# EAGLE design Cargador_Baterias (EAGLE 9.6.2)
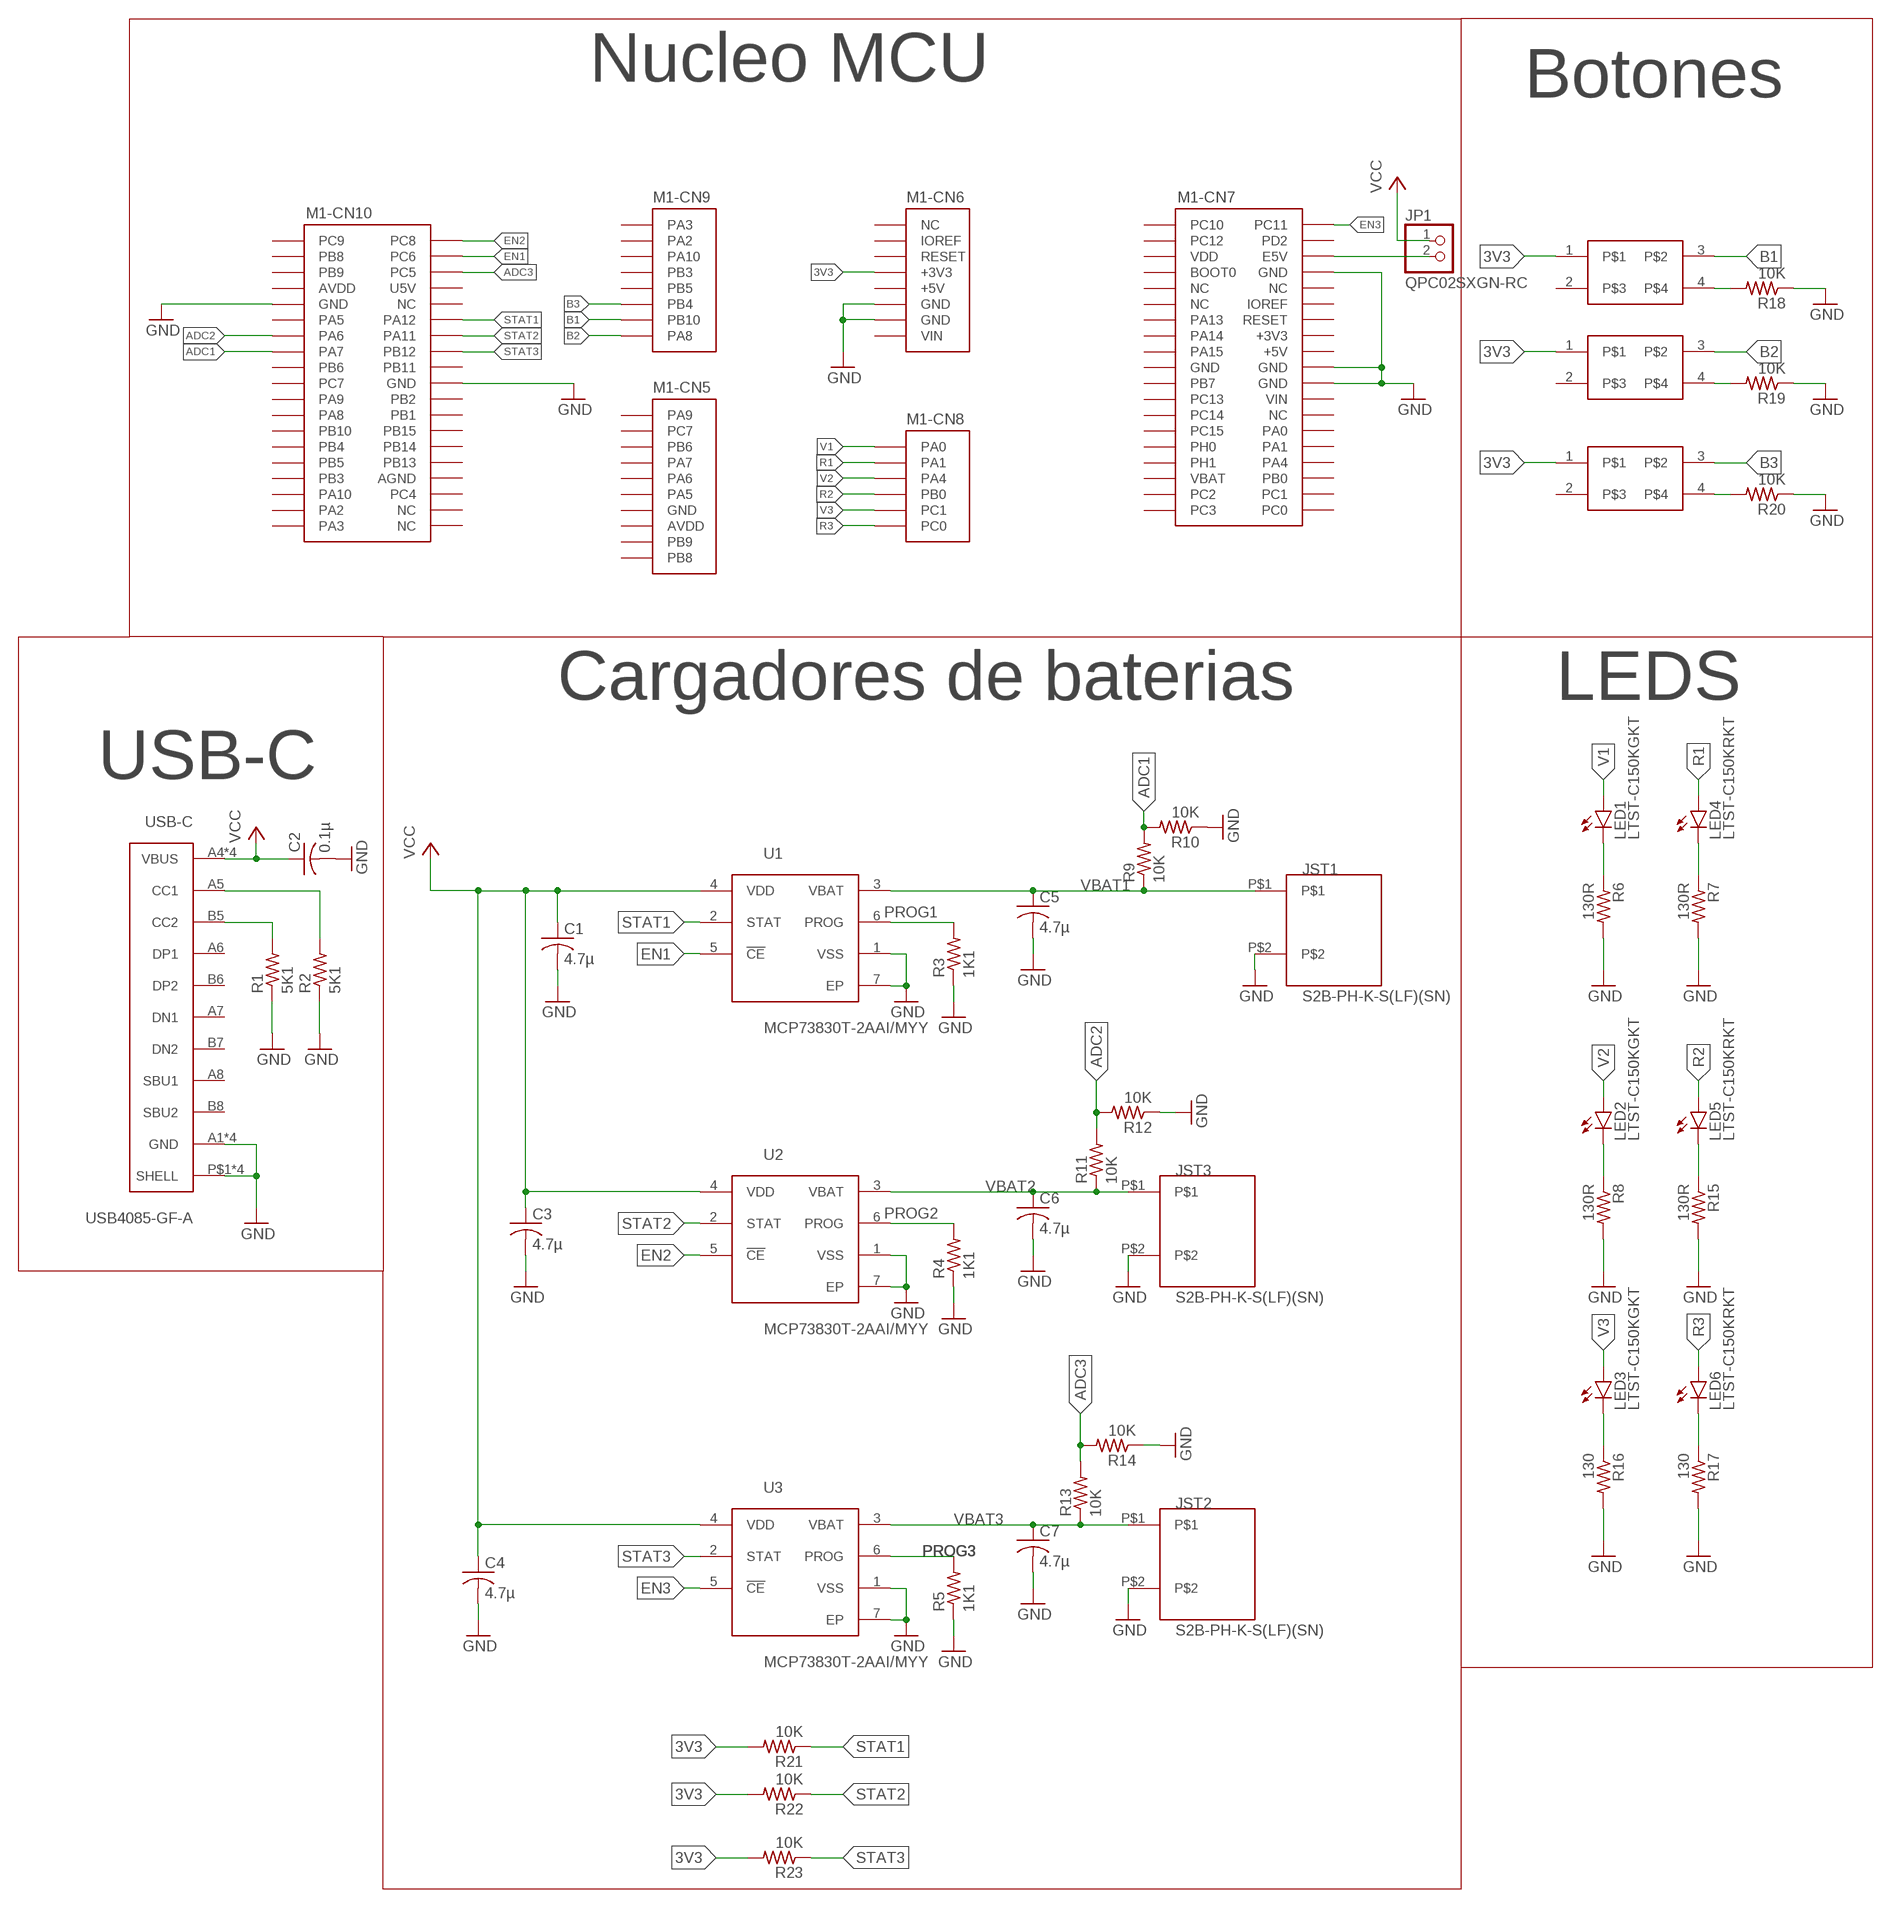
[diagram p0: schematic, sheet 1]

## Parts
BOTON1  PTS645SM43SMTR92 LFS  PTS645SM43SMTR92LFS  [PTS645SM43SMTR92LFS]
BOTON2  PTS645SM43SMTR92 LFS  PTS645SM43SMTR92LFS  [PTS645SM43SMTR92LFS]
BOTON3  PTS645SM43SMTR92 LFS  PTS645SM43SMTR92LFS  [PTS645SM43SMTR92LFS]
C1  4.7µ  C-USC0805  [C0805]
C2  0.1µ  C-USC0805  [C0805]
C3  4.7µ  C-USC0805  [C0805]
C4  4.7µ  C-USC0805  [C0805]
C5  4.7µ  C-USC0805  [C0805]
C6  4.7µ  C-USC0805  [C0805]
C7  4.7µ  C-USC0805  [C0805]
JP1  QPC02SXGN-RC  PINHD-1X2  [1X02]
JST1  S2B-PH-K-S(LF)(SN)  [BULK]
JST2  S2B-PH-K-S(LF)(SN)  [BULK]
JST3  S2B-PH-K-S(LF)(SN)  [BULK]
LED1  LTST-C150KGKT  LTST-C150KGKTSMT1206  [1206]
LED2  LTST-C150KGKT  LTST-C150KGKTSMT1206  [1206]
LED3  LTST-C150KGKT  LTST-C150KGKTSMT1206  [1206]
LED4  LTST-C150KRKT  LTST-C150KRKTSMT1206  [1206]
LED5  LTST-C150KRKT  LTST-C150KRKTSMT1206  [1206]
LED6  LTST-C150KRKT  LTST-C150KRKTSMT1206  [1206]
M1  NUCLEO-L452RE  [NUCLEO-64]
R1  5K1  R-US_R0805  [R0805]
R2  5K1  R-US_R0805  [R0805]
R3  1K1  R-US_R0805  [R0805]
R4  1K1  R-US_R0805  [R0805]
R5  1K1  R-US_R0805  [R0805]
R6  130R  R-US_R0805  [R0805]
R7  130R  R-US_R0805  [R0805]
R8  130R  R-US_R0805  [R0805]
R9  10K  R-US_R0805  [R0805]
R10  10K  R-US_R0805  [R0805]
R11  10K  R-US_R0805  [R0805]
R12  10K  R-US_R0805  [R0805]
R13  10K  R-US_R0805  [R0805]
R14  10K  R-US_R0805  [R0805]
R15  130R  R-US_R0805  [R0805]
R16  130  R-US_R0805  [R0805]
R17  130  R-US_R0805  [R0805]
R18  10K  R-US_R0805  [R0805]
R19  10K  R-US_R0805  [R0805]
R20  10K  R-US_R0805  [R0805]
R21  10K  R-US_R0805  [R0805]
R22  10K  R-US_R0805  [R0805]
R23  10K  R-US_R0805  [R0805]
U1  MCP73830T-2AAI/MYY  [6-TDFN(2X2)]
U2  MCP73830T-2AAI/MYY  [6-TDFN(2X2)]
U3  MCP73830T-2AAI/MYY  [6-TDFN(2X2)]
USB-C  USB4085-GF-A  [USB4085-GF-A]

## Nets
3V3: BOTON1.1 BOTON2.1 BOTON3.1 M1.CN6-4(-CN6:+3V3) R21.2 R22.2 R23.2
ADC1: M1.CN10-15(-CN10:PA7) R9.2 R10.2
ADC2: M1.CN10-13(-CN10:PA6) R11.2 R12.2
ADC3: M1.CN10-6(-CN10:PC5) R13.2 R14.2
B1: BOTON1.3 M1.CN9-7(-CN9:PB10)
B2: BOTON2.3 M1.CN9-8(-CN9:PA8)
B3: BOTON3.3 M1.CN9-6(-CN9:PB4)
EN1: M1.CN10-4(-CN10:PC6) U1.5(!CE)
EN2: M1.CN10-2(-CN10:PC8) U2.5(!CE)
EN3: M1.CN7-2(-CN7:PC11) U3.5(!CE)
GND: C1.2 C2.2 C3.2 C4.2 C5.2 C6.2 C7.2 JST1.P$2 JST2.P$2 JST3.P$2 M1.CN6-6(-CN6:GND) M1.CN6-7(-CN6:GND) M1.CN7-19(-CN7:GND) M1.CN7-20(-CN7:GND) M1.CN7-22(-CN7:GND) M1.CN10-9(-CN10:GND) M1.CN10-20(-CN10:GND) R1.1 R2.1 R3.1 R4.1 R5.1 R6.2 R7.2 R8.2 R10.1 R12.1 R14.1 R15.2 R16.2 R17.2 R18.1 R19.1 R20.1 U1.1(VSS) U1.7(EP) U2.1(VSS) U2.7(EP) U3.1(VSS) U3.7(EP) USB-C.A1(GND) USB-C.A12(GND) USB-C.B1(GND) USB-C.B12(GND) USB-C.P$1(SHELL) USB-C.P$2(SHELL) USB-C.P$3(SHELL) USB-C.P$4(SHELL)
N$1: R1.2 USB-C.B5(CC2)
N$2: R2.2 USB-C.A5(CC1)
N$3: LED1.C R6.1
N$4: LED4.C R7.1
N$5: LED2.C R8.1
N$6: LED5.C R15.1
N$8: JP1.2 M1.CN7-6(-CN7:E5V)
N$10: LED3.C R16.1
N$11: LED6.C R17.1
N$12: BOTON1.4 R18.2
N$13: BOTON2.4 R19.2
N$14: BOTON3.4 R20.2
PROG1: R3.2 U1.6(PROG)
PROG2: R4.2 U2.6(PROG)
PROG3: R5.2 U3.6(PROG)
R1: LED4.A M1.CN8-2(-CN8:PA1)
R2: LED5.A M1.CN8-4(-CN8:PB0)
R3: LED6.A M1.CN8-6(-CN8:PC0)
STAT1: M1.CN10-12(-CN10:PA12) R21.1 U1.2(STAT)
STAT2: M1.CN10-14(-CN10:PA11) R22.1 U2.2(STAT)
STAT3: M1.CN10-16(-CN10:PB12) R23.1 U3.2(STAT)
V1: LED1.A M1.CN8-1(-CN8:PA0)
V2: LED2.A M1.CN8-3(-CN8:PA4)
V3: LED3.A M1.CN8-5(-CN8:PC1)
VBAT1: C5.1 JST1.P$1 R9.1 U1.3(VBAT)
VBAT2: C6.1 JST3.P$1 R11.1 U2.3(VBAT)
VBAT3: C7.1 JST2.P$1 R13.1 U3.3(VBAT)
VCC: C1.1 C2.1 C3.1 C4.1 JP1.1 U1.4(VDD) U2.4(VDD) U3.4(VDD) USB-C.A4(VBUS) USB-C.A9(VBUS) USB-C.B4(VBUS) USB-C.B9(VBUS)
Unconnected: BOTON1.2 BOTON2.2 BOTON3.2 M1.CN5-1(-CN5:PA9) M1.CN5-2(-CN5:PC7) M1.CN5-3(-CN5:PB6) M1.CN5-4(-CN5:PA7) M1.CN5-5(-CN5:PA6) M1.CN5-6(-CN5:PA5) M1.CN5-9(-CN5:PB9) M1.CN5-10(-CN5:PB8) M1.CN6-1(-CN6:NC) M1.CN6-3(-CN6:RESET) M1.CN7-1(-CN7:PC10) M1.CN7-3(-CN7:PC12) M1.CN7-4(-CN7:PD2) M1.CN7-7(-CN7:BOOT0) M1.CN7-9(-CN7:NC) M1.CN7-10(-CN7:NC) M1.CN7-11(-CN7:NC) M1.CN7-12(-CN7:IOREF) M1.CN7-13(-CN7:PA13) M1.CN7-14(-CN7:RESET) M1.CN7-15(-CN7:PA14) M1.CN7-17(-CN7:PA15) M1.CN7-21(-CN7:PB7) M1.CN7-23(-CN7:PC13) M1.CN7-25(-CN7:PC14) M1.CN7-26(-CN7:NC) M1.CN7-27(-CN7:PC15) M1.CN7-28(-CN7:PA0) M1.CN7-29(-CN7:PH0) M1.CN7-30(-CN7:PA1) M1.CN7-31(-CN7:PH1) M1.CN7-32(-CN7:PA4) M1.CN7-34(-CN7:PB0) M1.CN7-35(-CN7:PC2) M1.CN7-36(-CN7:PC1) M1.CN7-37(-CN7:PC3) M1.CN7-38(-CN7:PC0) M1.CN9-1(-CN9:PA3) M1.CN9-2(-CN9:PA2) M1.CN9-3(-CN9:PA10) M1.CN9-4(-CN9:PB3) M1.CN9-5(-CN9:PB5) M1.CN10-1(-CN10:PC9) M1.CN10-3(-CN10:PB8) M1.CN10-5(-CN10:PB9) M1.CN10-10(-CN10:NC) M1.CN10-11(-CN10:PA5) M1.CN10-17(-CN10:PB6) M1.CN10-18(-CN10:PB11) M1.CN10-19(-CN10:PC7) M1.CN10-21(-CN10:PA9) M1.CN10-22(-CN10:PB2) M1.CN10-23(-CN10:PA8) M1.CN10-24(-CN10:PB1) M1.CN10-25(-CN10:PB10) M1.CN10-26(-CN10:PB15) M1.CN10-27(-CN10:PB4) M1.CN10-28(-CN10:PB14) M1.CN10-29(-CN10:PB5) M1.CN10-30(-CN10:PB13) M1.CN10-31(-CN10:PB3) M1.CN10-33(-CN10:PA10) M1.CN10-34(-CN10:PC4) M1.CN10-35(-CN10:PA2) M1.CN10-36(-CN10:NC) M1.CN10-37(-CN10:PA3) M1.CN10-38(-CN10:NC) USB-C.A6(DP1) USB-C.A7(DN1) USB-C.A8(SBU1) USB-C.B6(DP2) USB-C.B7(DN2) USB-C.B8(SBU2)

## Notes on the sheet
- Nucleo MCU | Botones
- Cargadores de baterias | LEDS
- USB-C

## Power pins joined to a net without a drawn wire
+3V3: M1.CN7-16(-CN7:+3V3)
+5V: M1.CN6-5(-CN6:+5V) M1.CN7-18(-CN7:+5V)
AGND: M1.CN10-32(-CN10:AGND)
AVDD: M1.CN5-8(-CN5:AVDD) M1.CN10-7(-CN10:AVDD)
GND: M1.CN5-7(-CN5:GND) M1.CN7-8(-CN7:GND)
IOREF: M1.CN6-2(-CN6:IOREF)
U5V: M1.CN10-8(-CN10:U5V)
VBAT: M1.CN7-33(-CN7:VBAT)
VDD: M1.CN7-5(-CN7:VDD)
VIN: M1.CN6-8(-CN6:VIN) M1.CN7-24(-CN7:VIN)

## Library data of the parts
BOTON1-BOTON3 = PTS645SM43SMTR92 LFS:PTS645SM43SMTR92LFS; PARTNO: PTS645SM43SMTR92 LFS
C1 C3-C7 = rcl:C-US: CAPACITOR, American symbol; PARTNO: GRM21BR71C475KE51L; SPICEPREFIX: C
C2 = rcl:C-US: CAPACITOR, American symbol; PARTNO: GCJ21BL81H104KA01L; SPICEPREFIX: C
JP1 = pinhead:PINHD-1X2: PIN HEADER; PARTNO: QPC02SXGN-RC
JST1-JST3 = S2B-PH-K-SLFSN:S2B-PH-K-S(LF)(SN); PARTNO: S2B-PH-K-S(LF)(SN)
LED1-LED3 = LTST-C150KGKT:LTST-C150KGKT: LED OSRAM: - CHIPLED LG R971, LG N971, LY N971, LG Q971, LY Q971, LO R971, LY R971 LH N974, LH R974 LS Q976, LO Q976, LY Q976 LO Q996 - Hyper CHIPLED LW Q18S LB Q993, LB Q99A, LB R99A - SideLED LS A670, LO A670, LY A670, LG A670, LP A670 LB A673, LV A673, LT A673, LW A673 LH A674 LY A675 LS A676, LA A676, LO A676, LY A676, LW A676 LS A679, LY A679, LG A679 - Hyper Micro SIDELED® LS Y876, LA Y876, LO Y876, LY Y876 LT Y87S - SmartLED LW L88C, LW L88S LB L89C, LB L89S, LG L890 LS L89K, LO L89K, LY L89K LS L896, LA L896, LO L896, LY L896 - TOPLED LS T670, LO T670, LY T670, LG T670, LP T670 LSG T670, LSP T670, LSY T670, LOP T670, LYG T670 LG T671, LOG T671, LSG T671 LB T673, LV T673, LT T673, LW T673 LH T674 LS T676, LA T676, LO T676, LY T676, LB T676, LH T676, LSB T676, LW T676 LB T67C, LV T67C, LT T67C, LS T67K, LO T67K, LY T67K, LW E67C LS E67B, LA E67B, LO E67B, LY E67B, LB E67C, LV E67C, LT E67C LW T67C LS T679, LY T679, LG T679 LS T770, LO T770, LY T770, LG T770, LP T770 LB T773, LV T773, LT T773, LW T773 LH T774 LS E675, LA E675, LY E675, LS T675 LS T776, LA T776, LO T776, LY T776, LB T776 LHGB T686 LT T68C, LB T68C - Hyper Mini TOPLED® LB M676 - Mini TOPLED Santana® LG M470 LS M47K, LO M47K, LY M47K Source: http://www.osram.convergy.de LUXEON: - LUMILED® LXK2-PW12-R00, LXK2-PW12-S00, LXK2-PW14-U00, LXK2-PW14-V00 LXK2-PM12-R00, LXK2-PM12-S00, LXK2-PM14-U00 LXK2-PE12-Q00, LXK2-PE12-R00, LXK2-PE12-S00, LXK2-PE14-T00, LXK2-PE14-U00 LXK2-PB12-K00, LXK2-PB12-L00, LXK2-PB12-M00, LXK2-PB14-N00, LXK2-PB14-P00, LXK2-PB14-Q00 LXK2-PR12-L00, LXK2-PR12-M00, LXK2-PR14-Q00, LXK2-PR14-R00 LXK2-PD12-Q00, LXK2-PD12-R00, LXK2-PD12-S00 LXK2-PH12-R00, LXK2-PH12-S00 LXK2-PL12-P00, LXK2-PL12-Q00, LXK2-PL12-R00 Source: www.luxeon.com KINGBRIGHT: KA-3528ASYC Source: www.kingbright.com; COLOR: VERDE; PARTNO: LTST-C150KGKT
LED4-LED6 = LTST-C150KRKT:LTST-C150KRKT: LED OSRAM: - CHIPLED LG R971, LG N971, LY N971, LG Q971, LY Q971, LO R971, LY R971 LH N974, LH R974 LS Q976, LO Q976, LY Q976 LO Q996 - Hyper CHIPLED LW Q18S LB Q993, LB Q99A, LB R99A - SideLED LS A670, LO A670, LY A670, LG A670, LP A670 LB A673, LV A673, LT A673, LW A673 LH A674 LY A675 LS A676, LA A676, LO A676, LY A676, LW A676 LS A679, LY A679, LG A679 - Hyper Micro SIDELED® LS Y876, LA Y876, LO Y876, LY Y876 LT Y87S - SmartLED LW L88C, LW L88S LB L89C, LB L89S, LG L890 LS L89K, LO L89K, LY L89K LS L896, LA L896, LO L896, LY L896 - TOPLED LS T670, LO T670, LY T670, LG T670, LP T670 LSG T670, LSP T670, LSY T670, LOP T670, LYG T670 LG T671, LOG T671, LSG T671 LB T673, LV T673, LT T673, LW T673 LH T674 LS T676, LA T676, LO T676, LY T676, LB T676, LH T676, LSB T676, LW T676 LB T67C, LV T67C, LT T67C, LS T67K, LO T67K, LY T67K, LW E67C LS E67B, LA E67B, LO E67B, LY E67B, LB E67C, LV E67C, LT E67C LW T67C LS T679, LY T679, LG T679 LS T770, LO T770, LY T770, LG T770, LP T770 LB T773, LV T773, LT T773, LW T773 LH T774 LS E675, LA E675, LY E675, LS T675 LS T776, LA T776, LO T776, LY T776, LB T776 LHGB T686 LT T68C, LB T68C - Hyper Mini TOPLED® LB M676 - Mini TOPLED Santana® LG M470 LS M47K, LO M47K, LY M47K Source: http://www.osram.convergy.de LUXEON: - LUMILED® LXK2-PW12-R00, LXK2-PW12-S00, LXK2-PW14-U00, LXK2-PW14-V00 LXK2-PM12-R00, LXK2-PM12-S00, LXK2-PM14-U00 LXK2-PE12-Q00, LXK2-PE12-R00, LXK2-PE12-S00, LXK2-PE14-T00, LXK2-PE14-U00 LXK2-PB12-K00, LXK2-PB12-L00, LXK2-PB12-M00, LXK2-PB14-N00, LXK2-PB14-P00, LXK2-PB14-Q00 LXK2-PR12-L00, LXK2-PR12-M00, LXK2-PR14-Q00, LXK2-PR14-R00 LXK2-PD12-Q00, LXK2-PD12-R00, LXK2-PD12-S00 LXK2-PH12-R00, LXK2-PH12-S00 LXK2-PL12-P00, LXK2-PL12-Q00, LXK2-PL12-R00 Source: www.luxeon.com KINGBRIGHT: KA-3528ASYC Source: www.kingbright.com; COLOR: ROJO; PARTNO: LTST-C150KRKT
M1 = NUCLEO-L452RE:NUCLEO-L452RE: No existe un outline (Layer Dimension) para esta librería. En su lugar se utilizó una referencia en tDocu. Al momento de diseñar la tarjeta, el Dimension debe ser dibujado según los requerimientos del usuario, o simplemente copiar los contenidos del tDocu en Dimensions.; PARTNO: NUCLEO-L452RE
R1 R2 = rcl:R-US_: RESISTOR, American symbol; PARTNO: RC0805FR-075K1L; SPICEPREFIX: R
R3-R5 = rcl:R-US_: RESISTOR, American symbol; PARTNO: RC0805FR-071K1L; SPICEPREFIX: R
R6-R8 R15-R17 = rcl:R-US_: RESISTOR, American symbol; PARTNO: RC0805FR-07130RL; SPICEPREFIX: R
R9-R14 R18-R23 = rcl:R-US_: RESISTOR, American symbol; PARTNO: RC0805JR-1310KL; SPICEPREFIX: R
U1-U3 = MCP73830T-2AAI-MYY - Microchip Technology:MCP73830T-2AAI/MYY; PARTNO: MCP73830T-2AAI/MYY
USB-C = USB4085-GF-A:USB4085-GF-A; PARTNO: USB4085-GF-A

## Board
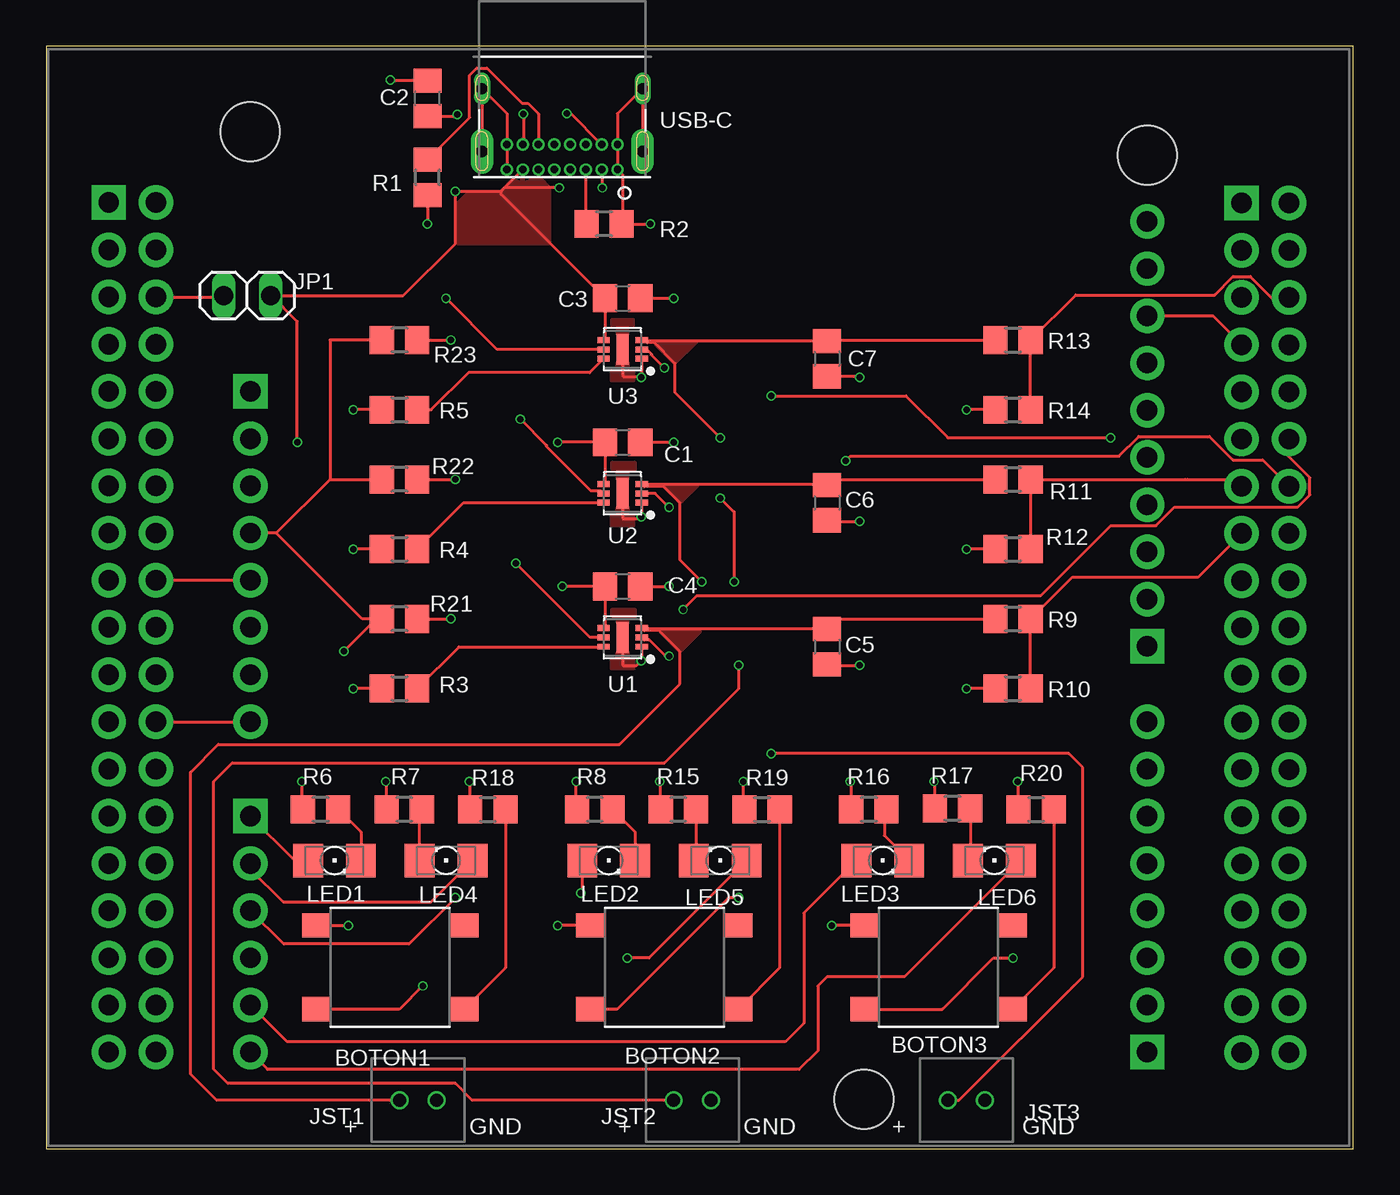
[diagram p1: board, top side]
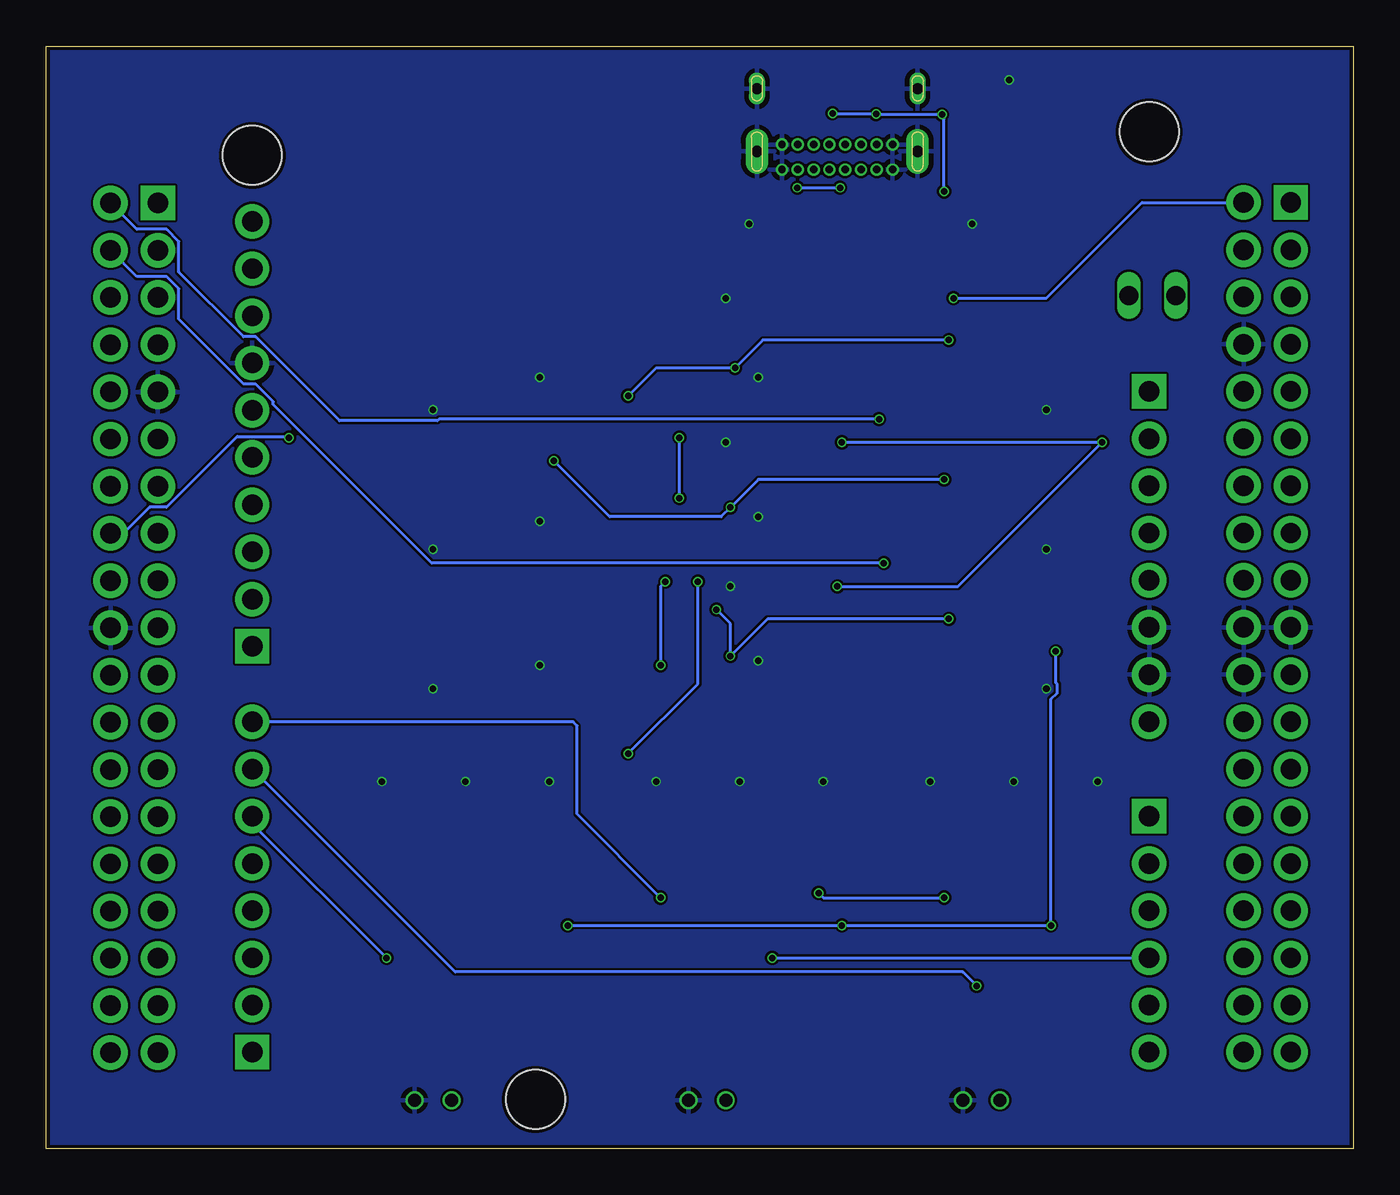
[diagram p2: board, bottom side, seen from below]

Size 70.3 x 59.3 mm. Coordinates in mm from the lower left corner, seen from the top.
Outline: 0,0 70.3,0 70.3,59.3 0,59.3 0,0
Copper layers (1*16): Top 0.035mm / dielectric 1.6mm / Bottom 0.035mm
Design rules "jlcpcb-2layers *": minimum track width 5mil, minimum drill 0.3mm, track to track 5mil, track to pad 5mil, pad to pad 5mil, via to via 5mil, smd to smd 5mil, copper to edge 0.2mm, drill to drill 6mil, minimum pad ring 0.13mm, minimum via ring 3mil, stop-mask expansion 4mil, vias tented up to drill 15mil, thermal gap 10mil

### Footprints (pad centres in the part's own frame; a part is rotated, then mirrored left to right if it is on the bottom)
PTS645SM43SMTR92LFS = smd 1.55 x 1.3: 1 -3.975,2.25; 2 3.975,2.25; 3 -3.975,-2.25; 4 3.975,-2.25
C0805 = smd 1.3 x 1.5: 1 -0.95,0; 2 0.95,0
1X02 = drill 1.016 long: 1 -1.27,0; 2 1.27,0
BULK = drill 0.7: P$1 -1,0; P$2 1,0
1206 = smd 1.6 x 1.803: A -1.422,0; C 1.422,0
NUCLEO-64 = drill 1.1 pad 1.85 square: CN5-1 59.13,24.884; CN6-1 10.87,38.6; CN7-1 3.25,48.76; CN8-1 10.87,15.74; CN9-1 59.13,3.04; CN10-1 64.21,48.735 | drill 1.1 pad 1.85: CN5-2 59.13,27.424; CN5-3 59.13,29.964; CN5-4 59.13,32.504; CN5-5 59.13,35.044; CN5-6 59.13,37.584; CN5-7 59.13,40.124; CN5-8 59.13,42.664; CN5-9 59.13,45.204; CN5-10 59.13,47.744; CN6-2 10.87,36.06; CN6-3 10.87,33.52; CN6-4 10.87,30.98; CN6-5 10.87,28.44; CN6-6 10.87,25.9; CN6-7 10.87,23.36; CN6-8 10.87,20.82; CN7-2 5.79,48.76; CN7-3 3.25,46.22; CN7-4 5.79,46.22; CN7-5 3.25,43.68; CN7-6 5.79,43.68; CN7-7 3.25,41.14; CN7-8 5.79,41.14; CN7-9 3.25,38.6; CN7-10 5.79,38.6; CN7-11 3.25,36.06; CN7-12 5.79,36.06; CN7-13 3.25,33.52; CN7-14 5.79,33.52; CN7-15 3.25,30.98; CN7-16 5.79,30.98; CN7-17 3.25,28.44; CN7-18 5.79,28.44; CN7-19 3.25,25.9; CN7-20 5.79,25.9; CN7-21 3.25,23.36; CN7-22 5.79,23.36; CN7-23 3.25,20.82; CN7-24 5.79,20.82; CN7-25 3.25,18.28; CN7-26 5.79,18.28; CN7-27 3.25,15.74; CN7-28 5.79,15.74; CN7-29 3.25,13.2; CN7-30 5.79,13.2; CN7-31 3.25,10.66; CN7-32 5.79,10.66; CN7-33 3.25,8.12; CN7-34 5.79,8.12; CN7-35 3.25,5.58; CN7-36 5.79,5.58; CN7-37 3.25,3.04; CN7-38 5.79,3.04; CN8-2 10.87,13.2; CN8-3 10.87,10.66; CN8-4 10.87,8.12; CN8-5 10.87,5.58; CN8-6 10.87,3.04; CN9-2 59.13,5.58; CN9-3 59.13,8.12; CN9-4 59.13,10.66; CN9-5 59.13,13.2; CN9-6 59.13,15.74; CN9-7 59.13,18.28; CN9-8 59.13,20.82; CN10-2 66.75,48.735; CN10-3 64.21,46.195; CN10-4 66.75,46.195; CN10-5 64.21,43.655; CN10-6 66.75,43.655; CN10-7 64.21,41.115; CN10-8 66.75,41.115; CN10-9 64.21,38.575; CN10-10 66.75,38.575; CN10-11 64.21,36.035; CN10-12 66.75,36.035; CN10-13 64.21,33.495; CN10-14 66.75,33.495; CN10-15 64.21,30.955; CN10-16 66.75,30.955; CN10-17 64.21,28.415; CN10-18 66.75,28.415; CN10-19 64.21,25.875; CN10-20 66.75,25.875; CN10-21 64.21,23.335; CN10-22 66.75,23.335; CN10-23 64.21,20.795; CN10-24 66.75,20.795; CN10-25 64.21,18.255; CN10-26 66.75,18.255; CN10-27 64.21,15.715; CN10-28 66.75,15.715; CN10-29 64.21,13.175; CN10-30 66.75,13.175; CN10-31 64.21,10.635; CN10-32 66.75,10.635; CN10-33 64.21,8.095; CN10-34 66.75,8.095; CN10-35 64.21,5.555; CN10-36 66.75,5.555; CN10-37 64.21,3.015; CN10-38 66.75,3.015 | hole 3.175: 59.13,51.3; 10.87,52.57; 43.89,0.5
R0805 = smd 1.3 x 1.5: 1 -0.95,0; 2 0.95,0
6-TDFN(2X2) = smd 0.661 x 0.32: 1 -1.026,0.5; 2 -1.026,0; 3 -1.026,-0.5; 4 1.026,-0.5; 5 1.026,0; 6 1.026,0.5 | smd 0.65 x 1.65: 7 0,0
USB4085-GF-A = drill 0.4 pad 0.65: A1 -2.975,4.325; A4 -2.125,4.325; A5 -1.275,4.325; A6 -0.425,4.325; A7 0.425,4.325; A8 1.275,4.325; A9 2.125,4.325; A12 2.975,4.325; B1 2.975,2.975; B4 2.125,2.975; B5 1.275,2.975; B6 0.425,2.975; B7 -0.425,2.975; B8 -1.275,2.975; B9 -2.125,2.975; B12 -2.975,2.975 | drill 0.6 pad 1.2 long: P$1 -4.325,3.345; P$2 4.325,3.345 | drill 0.6 pad 0.85 long: P$3 -4.325,-0.035; P$4 4.325,-0.035

### Placement (x,y rotation side)
BOTON1  18.5,9.75 0 top
BOTON2  33.25,9.75 0 top
BOTON3  48,9.75 0 top
C1  31,38 0 top
C2  20.5,56.5 90 top
C3  31,45.75 0 top
C4  31,30.25 0 top
C5  42,27 270 top
C6  42,34.75 270 top
C7  42,42.5 270 top
JP1  10.8,45.9 180 top
JST1  20,2.6 0 top
JST2  34.75,2.6 0 top
JST3  49.5,2.6 0 top
LED1  15.5,15.5 0 top
LED2  30.25,15.5 0 top
LED3  45,15.5 0 top
LED4  21.5,15.5 180 top
LED5  36.25,15.5 180 top
LED6  51,15.5 180 top
M1  0.1,2.14 0 top
R1  20.5,52.25 90 top
R2  30,49.75 180 top
R3  19,24.75 0 top
R4  19,32.25 0 top
R5  19,39.75 0 top
R6  14.75,18.25 180 top
R7  19.25,18.25 180 top
R8  29.5,18.25 180 top
R9  52,28.5 0 top
R10  52,24.75 0 top
R11  52,36 0 top
R12  52,32.25 0 top
R13  52,43.5 0 top
R14  52,39.75 0 top
R15  34,18.25 180 top
R16  44.25,18.25 180 top
R17  48.75,18.3 180 top
R18  23.75,18.25 0 top
R19  38.5,18.25 0 top
R20  53.25,18.25 0 top
R21  19,28.5 180 top
R22  19,36 180 top
R23  19,43.5 180 top
U1  31,27.5 180 top
U2  31,35.25 180 top
U3  31,43 180 top
USB-C  27.75,57 180 top

### Tracks (layer width: path | path; a pad name or v marks a point on that pad's centre or on a via)
3V3  (via drill 0.35)
  Top 0.152: R23.2 15.25,43.5 15.25,36 | 15.25,36 R22.2 | 12.37,33.12 15.25,36 | 12.37,33.12 M1.CN6-4 | 12.37,33.12 16.99,28.5 R21.2 17.75,28.5 v16,26.75 | BOTON1.1 v16.25,12 | BOTON2.1 v27.5,12 | BOTON3.1 v42.25,12
  Bottom 0.152: v16,26.75 16,25.07 15.92,24.99 15.92,24.51 16.25,24.18 v16.25,12 v27.5,12 v42.25,12
+5V
  Top 0.152: M1.CN7-18 M1.CN6-5
ADC1
  Top 0.152: R10.2 R9.2 55.2,30.75 61.97,30.75 M1.CN10-15
ADC2
  Top 0.152: R12.2 R11.2 61.25,36 61.41,36 63.95,36 M1.CN10-13
ADC3
  Top 0.152: M1.CN10-6 65.91,45.8 64.78,46.92 63.84,46.92 62.85,45.93 55.38,45.93 R13.2 R14.2
AVDD
  Top 0.152: M1.CN5-8 62.76,44.8 M1.CN10-7
B1  (via drill 0.35)
  Top 0.152: v20.25,8.75 19,7.5 BOTON1.3
  Bottom 0.152: v20.25,8.75 21,9.5 48.31,9.5 M1.CN9-7
B2  (via drill 0.35)
  Top 0.152: v37.25,13.5 36.7,13.5 30.7,7.5 BOTON2.3
  Bottom 0.152: v37.25,13.5 41.75,18 41.75,22.75 41.96,22.96 M1.CN9-8
B3  (via drill 0.35)
  Top 0.152: 51.98,10.28 v52,10.25 50.95,10.25 48.2,7.5 BOTON3.3
  Bottom 0.152: v52,10.25 59.23,17.48 M1.CN9-6
EN1  (via drill 0.35)
  Top 0.152: U1.5 29.25,27.5 v25.25,31.5
  Bottom 0.152: M1.CN10-4 65.44,46.92 63.84,46.92 63.18,46.26 63.18,44.62 59.7,41.14 59.05,41.14 58.1,40.19 58.1,40.03 49.57,31.5 v25.25,31.5
EN2  (via drill 0.35)
  Top 0.152: U2.5 29.84,35.39 29.29,35.39 26.92,37.76 26.92,37.83 v25.5,39.25
  Bottom 0.152: v25.5,39.25 49.18,39.25 49.26,39.17 54.54,39.17 59.05,43.68 59.7,43.68 63.18,47.16 63.18,48.8 63.84,49.46 65.44,49.46 M1.CN10-2
EN3  (via drill 0.35)
  Top 0.152: U3.5 24.25,43 v21.5,45.75
  Bottom 0.152: v21.5,45.75 16.5,45.75 11.35,50.9 M1.CN7-2
GND  (via drill 0.35)
  Top 0.152: R5.1 v16.5,39.75 | R4.1 v16.5,32.25 | R3.1 v16.5,24.75 | C7.2 43.7,41.55 v43.75,41.5 | C6.2 42.05,33.75 v43.75,33.75 | C5.2 42.05,26 v43.75,26 | R14.1 v49.5,39.75 | R12.1 v49.5,32.25 | R10.1 v49.5,24.75 | R20.1 52.3,19.7 v52.25,19.75 | R19.1 37.5,18.3 v37.5,19.75 | R15.2 33.05,19.7 v33,19.75 | R18.1 22.8,19.7 v22.75,19.75 | R7.2 18.3,19.7 v18.25,19.75 | R6.2 13.75,18.3 v13.75,19.75 | USB-C.P$2 USB-C.P$4 24.77,55.69 USB-C.B1 USB-C.A12 | USB-C.P$1 USB-C.P$3 30.73,55.69 USB-C.B12 USB-C.A1 31,52.4 31,49.75 | C2.2 18.55,57.45 v18.5,57.5 | R1.1 v20.5,49.75 | R2.1 31,49.75 | 31,49.75 v32.5,49.75 | C3.2 v33.75,45.75 | C1.2 v33.75,38 | C4.2 v33.5,30.25 | U2.1 32.03,34.03 v32,34 31.9,33.9 31,33.9 U2.7 | U1.1 32.03,26.28 v32,26.25 31.75,26 31,26 U1.7 | U3.1 32.03,41.53 | 32.03,41.53 v32,41.5 | R16.2 43.3,19.7 v43.25,19.75 | R17.2 47.8,19.7 v47.75,19.75 | R8.2 28.5,18.3 v28.5,19.75 | U3.7 31,41.6 31.07,41.53 32.03,41.53
  pour Bottom: 0,0 70.25,0 70.25,59.25 0,59.25
  pour Top: 30.7,28.3 31.3,28.3 31.3,28.6 31.7,28.6 31.7,29 30.4,29 30.4,28.7 30.5,28.6 30.7,28.6
  pour Top: 30.7,26.7 31.3,26.7 31.3,26.3 31.6,26.3 31.6,25.8 30.4,25.8 30.4,26.3 30.7,26.3
  pour Top: 30.7,36 31.3,36 31.3,36.5 31.7,36.5 31.7,36.9 30.4,36.9 30.4,36.6 30.7,36.6
  pour Top: 30.7,42.3 31.3,42.3 31.3,41.8 31.6,41.8 31.6,41.3 30.4,41.3 30.4,41.9 30.7,41.9
  pour Top: 30.7,43.8 31.3,43.8 31.3,44.2 31.6,44.2 31.6,44.6 30.4,44.6 30.4,44.3 30.6,44.3 30.7,44.2
  pour Top: 30.7,34.5 31.3,34.5 31.3,34.1 31.6,34.1 31.6,33.5 30.4,33.5 30.4,34.1 30.7,34.1
N$1
  Top 0.152: R1.2 22.77,55.47 22.77,57.76 23.15,58.14 23.7,58.14 25.59,56.24 25.9,56.24 26.48,55.67 USB-C.B5
N$2
  Top 0.152: R2.2 29.02,49.77 USB-C.A5
N$3
  Top 0.152: R6.1 16.92,17.03 LED1.C
N$4
  Top 0.152: LED4.C 20.08,18.13 R7.1
N$5
  Top 0.152: R8.1 31.67,17.03 LED2.C
N$6
  Top 0.152: R15.1 34.95,15.62 LED5.C
N$8
  Top 0.152: M1.CN7-6 9.45,45.82 JP1.2
N$10
  Top 0.152: R16.1 45.08,18.13 45.08,16.84 LED3.C
N$11
  Top 0.152: R17.1 49.7,15.62 LED6.C
N$12
  Top 0.152: R18.2 24.7,9.72 BOTON1.4
N$13
  Top 0.152: R19.2 39.45,9.72 BOTON2.4
N$14
  Top 0.152: R20.2 54.2,9.72 BOTON3.4
PROG1
  Top 0.152: R3.2 22.2,27 U1.6
PROG2
  Top 0.152: R4.2 22.45,34.75 U2.6
PROG3
  Top 0.152: R5.2 20.7,39.75 22.7,41.75 29.22,41.75 U3.6
R1
  Top 0.152: LED4.A 20.67,13.25 12.75,13.25 10.97,15.03 M1.CN8-2
R2  (via drill 0.35)
  Top 0.152: LED5.A 32.42,10.25 v31.25,10.25
  Bottom 0.152: v31.25,10.25 M1.CN8-4
R3
  Top 0.152: LED6.A 46.17,9.25 42,9.25 41.5,8.75 41.5,5.25 40.5,4.25 11.9,4.25 M1.CN8-6
STAT1  (via drill 0.35)
  Top 0.152: R21.1 v21.75,28.5 | U1.2 32.16,27.36 32.44,27.36 33.3,26.5 v33.5,26.5 | v34.25,29 35,29.75 53.5,29.75 57.27,33.52 59.7,33.52 60.69,34.51 67.32,34.51 67.98,35.17 67.98,36.1 66.85,37.23 M1.CN10-12
  Bottom 0.152: v21.75,28.5 31.5,28.5 v33.5,26.5 33.5,28.25 v34.25,29
STAT2  (via drill 0.35)
  Top 0.152: R22.1 v22,36 | v33.5,34.5 32.75,35.25 U2.2 | v43,37 43.25,37.25 57.7,37.25 58.76,38.31 62.58,38.31 63.84,37.05 65.44,37.05 M1.CN10-14
  Bottom 0.152: v22,36 32,36 v33.5,34.5 34,34 40,34 v43,37
STAT3  (via drill 0.35)
  Top 0.152: R23.1 v21.75,43.5 | v33.25,42 32.56,42.69 32.56,42.74 32.3,43 U3.2 | v39,40.5 46.25,40.5 48.5,38.25 v57.25,38.25
  Bottom 0.152: v21.75,43.5 31.75,43.5 v33.25,42 37.5,42 v39,40.5 | v57.25,38.25 57.31,38.31 60.04,38.31 63.84,34.51 64.74,34.51 66.25,33 66.75,33 M1.CN10-16
V1
  Top 0.152: LED1.A 13.35,15.5 M1.CN8-1
V2  (via drill 0.35)
  Top 0.152: LED2.A 28.83,13.83 v28.75,13.75 | v22,13.5 19.5,11 12.77,11 M1.CN8-3
  Bottom 0.152: v28.75,13.75 28.5,13.5 v22,13.5
V3
  Top 0.152: LED3.A 40.75,12.67 40.75,6.75 39.75,5.75 12.94,5.75 M1.CN8-5
VBAT1
  Top 0.152: R9.1 42.55,28.5 C5.1 32.08,27.95 U1.3 32.16,27.86 32.96,27.86 34.08,26.74 34.08,25.01 30.82,21.75 9.25,21.75 7.75,20.25 7.75,4 9.15,2.6 JST1.P$1
  pour Top: 33,27.8 34.1,26.7 35.2,27.8 35.2,27.9 33,27.9
VBAT2  (via drill 0.35)
  Top 0.152: R11.1 42.3,36 C6.1 41.95,35.75 U2.3 32.16,35.61 33.21,35.61 34.08,34.74 34.08,31.67 v35.25,30.5 | JST3.P$1 49.1,2.6 55.75,9.25 55.75,20.5 55,21.25 v39,21.25
  Bottom 0.152: v39,21.25 35.25,25 v35.25,30.5
  pour Top: 34.1,34.8 34.2,34.8 35.1,35.7 33.1,35.7 34,34.8
VBAT3  (via drill 0.35)
  Top 0.152: 32.25,43.45 C7.1 42.05,43.5 R13.1 | 32.25,43.45 32.08,43.45 U3.3 | JST2.P$1 22.9,2.6 22,3.5 9.75,3.5 9,4.25 9,19.75 10,20.75 33.25,20.75 37.25,24.75 v37.25,26 | v36.25,35 37,34.25 v37,30.5 | v36.25,38.25 33.83,40.67 33.83,42.24 32.71,43.36 32.34,43.36 32.25,43.45
  Bottom 0.152: v37,30.5 37.25,30.25 v37.25,26 | v36.25,35 v36.25,38.25
  pour Top: 32.8,43.4 35,43.4 33.8,42.2 32.8,43.2
VCC  (via drill 0.35)
  Top 0.152: C2.1 22.03,55.55 v22.11,55.64 | v25.66,55.66 25.66,54.06 USB-C.B4 | USB-C.A9 24.65,51.7 | 24.45,51.5 v22,51.5 21.99,51.5 22,51.49 22,48.7 19.2,45.9 JP1.1 12.09,45.91 13.5,44.5 v13.5,38 | U1.4 30.05,28.08 C4.1 v27.75,30.25 | U2.4 30.05,35.83 C1.1 v27.5,38 | U3.4 30.05,43.58 C3.1 24.45,51.35 24.45,51.5 | USB-C.A4 29.9,52.65 v29.9,51.7 | v27.6,51.7 24.65,51.7 | 24.65,51.7 24.45,51.5 | USB-C.B9 28.2,55.7 v28,55.7
  Bottom 0.152: v22.11,55.64 22.25,55.64 | 22.25,55.64 25.64,55.64 v25.66,55.66 27.96,55.66 v28,55.7 | v22,51.5 22,55.39 22.25,55.64 | v27.5,38 v13.5,38 21.25,30.25 v27.75,30.25 | v29.9,51.7 v27.6,51.7
  pour Top: 22.1,48.7 27.1,48.7 27.1,51.7 26.6,52.2 25.1,52.2 24.4,51.5 22.7,51.5 22,50.8 22,48.8
VIN
  Top 0.152: M1.CN7-24 M1.CN6-8

### Text on the board
tPlace: + | GND | + | GND | + | GND